# EAGLE schematic circuit (EAGLE 9.6.2)
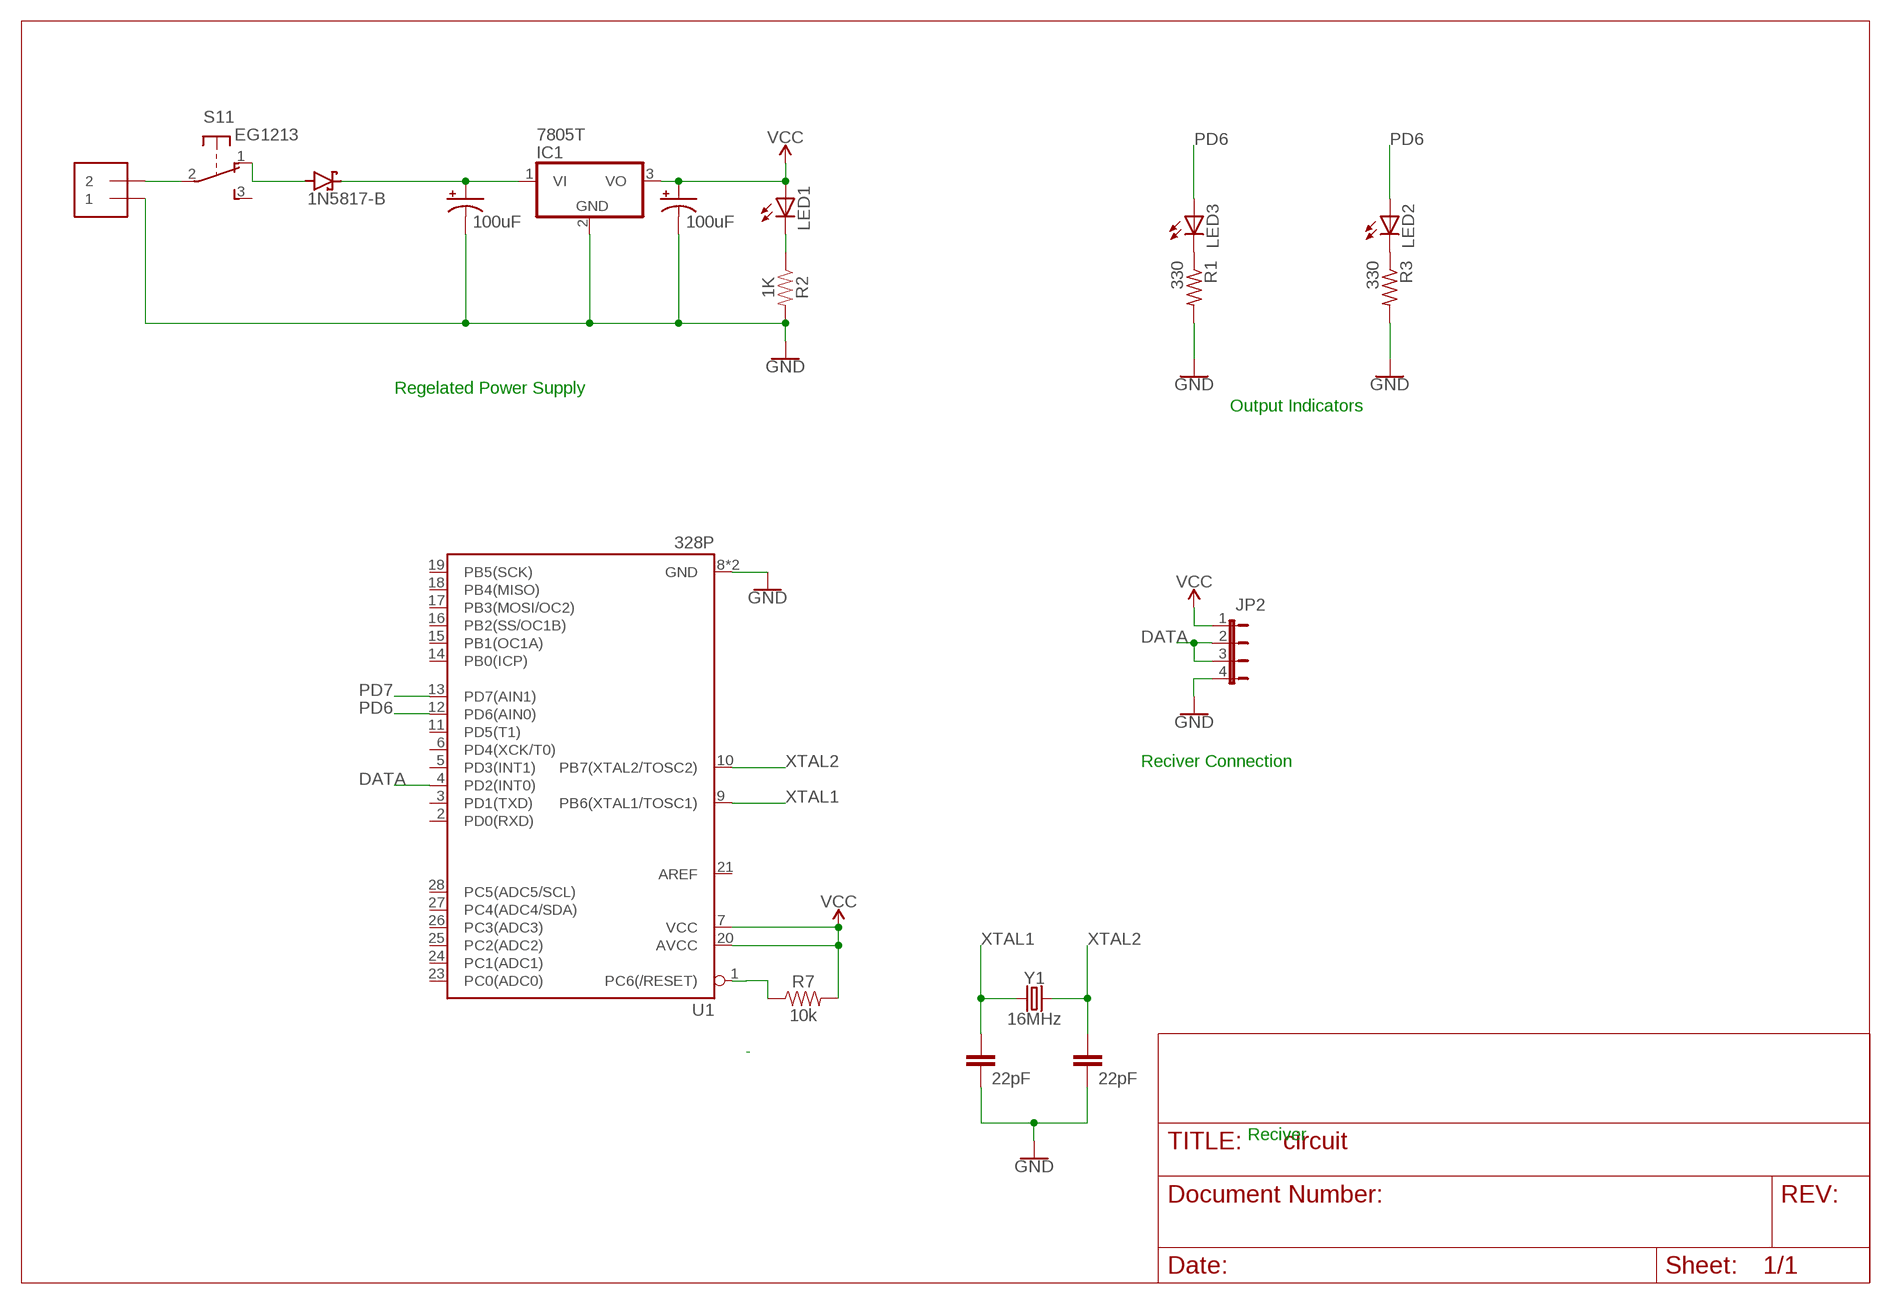
[diagram p0: schematic, sheet 1]

## Parts
$1_0_$_2023-02-20_05-34-40  100uF  100UF-POLAR-RADIAL-2.5MM-25V-20%  [CPOL-RADIAL-2.5MM-6.5MM]
$1_1_$_2023-02-20_05-34-40  100uF  100UF-POLAR-RADIAL-2.5MM-25V-20%  [CPOL-RADIAL-2.5MM-6.5MM]
$1_2_$_2023-02-20_05-34-40  22pF  22PF-PTH-2.54MM-200V-5%  [CAP-PTH-2.54]
$1_3_$_2023-02-20_05-34-40  22pF  22PF-PTH-2.54MM-200V-5%  [CAP-PTH-2.54]
$1_4_$_2023-02-20_05-34-40  1N5817-B  [DO41-7.6]
IC1  7805T  [TO220H]
J1  1X2-3.5MM  [1X2-3.5MM]
JP2  JP4E  [JP4]
LED1  LED3MM  [LED3MM]
LED2  LED3MM  [LED3MM]
LED3  LED3MM  [LED3MM]
R1  330  R-US_0207/5V  [0207/5V]
R2  1K  RESISTORAXIAL-0.3  [AXIAL-0.3]
R3  330  R-US_0207/5V  [0207/5V]
R7  10k  RESISTORAXIAL-0.3  [AXIAL-0.3]
S1  EG1213  [EG1213]
U1  328P  ATMEGA328P_PDIP  [DIP28]
Y1  16MHz  CRYSTAL-16MHZPTH-HC49US  [HC49US]

## Nets
DATA: JP2.2 JP2.3 U1.4(PD2(INT0))
GND: $1_0_$_2023-02-20_05-34-40.2(-) $1_1_$_2023-02-20_05-34-40.2(-) $1_2_$_2023-02-20_05-34-40.2 $1_3_$_2023-02-20_05-34-40.2 IC1.2(GND) J1.1 JP2.4 R1.2 R2.P$2 R3.2 U1.8(GND) U1.22(GND)
N$1: J1.2 S1.2(1:P)
N$2: $1_0_$_2023-02-20_05-34-40.1(+) $1_4_$_2023-02-20_05-34-40.C IC1.1(VI)
N$3: R7.P$1 U1.1(PC6(/RESET))
N$5: LED1.K(C) R2.P$1
N$6: $1_4_$_2023-02-20_05-34-40.A S1.1(1:O)
N$7: LED3.K(C) R1.1
N$8: LED2.K(C) R3.1
PD6: LED2.A LED3.A U1.12(PD6(AIN0))
PD7: U1.13(PD7(AIN1))
VCC: $1_1_$_2023-02-20_05-34-40.1(+) IC1.3(VO) JP2.1 LED1.A R7.P$2 U1.7(VCC) U1.20(AVCC)
XTAL1: $1_2_$_2023-02-20_05-34-40.1 U1.9(PB6(XTAL1/TOSC1)) Y1.1
XTAL2: $1_3_$_2023-02-20_05-34-40.1 U1.10(PB7(XTAL2/TOSC2)) Y1.2
Unconnected: S1.3(1:S) S1.MT1(MT) S1.MT2(MT) U1.2(PD0(RXD)) U1.3(PD1(TXD)) U1.5(PD3(INT1)) U1.6(PD4(XCK/T0)) U1.11(PD5(T1)) U1.14(PB0(ICP)) U1.15(PB1(OC1A)) U1.16(PB2(SS/OC1B)) U1.17(PB3(MOSI/OC2)) U1.18(PB4(MISO)) U1.19(PB5(SCK)) U1.21(AREF) U1.23(PC0(ADC0)) U1.24(PC1(ADC1)) U1.25(PC2(ADC2)) U1.26(PC3(ADC3)) U1.27(PC4(ADC4/SDA)) U1.28(PC5(ADC5/SCL))

## Notes on the sheet
- Regelated Power Supply
- Output Indicators
- Reciver Connection
- Reciver

## Library data of the parts
$1_0_$_2023-02-20_05-34-40 $1_1_$_2023-02-20_05-34-40 = SparkFun-Capacitors:100UF-POLAR: 100µF polarized capacitors A capacitor is a passive two-terminal electrical component used to store electrical energy temporarily in an electric field.; PROD_ID: CAP-08439
$1_2_$_2023-02-20_05-34-40 $1_3_$_2023-02-20_05-34-40 = SparkFun-Capacitors:22PF: 22pF ceramic capacitors A capacitor is a passive two-terminal electrical component used to store electrical energy temporarily in an electric field.; PROD_ID: CAP-09128
$1_4_$_2023-02-20_05-34-40 = diode:1N581*: 1.0A SCHOTTKY BARRIER RECTIFIER Source: http://www.diodes.com/datasheets/ds23001.pdf
IC1 = adafruit:78*: Positive VOLTAGE REGULATOR Added bigger pads to the TO-92 package
J1 = adafruit:1X2: 3.5mm Terminal block http://www.ladyada.net/library/pcb/eaglelibrary.html
JP2 = jumper:JP4E: JUMPER
LED1-LED3 = adafruit:LED: LED OSRAM: - CHIPLED LG R971, LG N971, LY N971, LG Q971, LY Q971, LO R971, LY R971 LH N974, LH R974 LS Q976, LO Q976, LY Q976 LO Q996 - Hyper CHIPLED LW Q18S LB Q993, LB Q99A, LB R99A - SideLED LS A670, LO A670, LY A670, LG A670, LP A670 LB A673, LV A673, LT A673, LW A673 LH A674 LY A675 LS A676, LA A676, LO A676, LY A676, LW A676 LS A679, LY A679, LG A679 - Hyper Micro SIDELED® LS Y876, LA Y876, LO Y876, LY Y876 LT Y87S - SmartLED LW L88C, LW L88S LB L89C, LB L89S, LG L890 LS L89K, LO L89K, LY L89K LS L896, LA L896, LO L896, LY L896 - TOPLED LS T670, LO T670, LY T670, LG T670, LP T670 LSG T670, LSP T670, LSY T670, LOP T670, LYG T670 LG T671, LOG T671, LSG T671 LB T673, LV T673, LT T673, LW T673 LH T674 LS T676, LA T676, LO T676, LY T676, LB T676, LH T676, LSB T676, LW T676 LB T67C, LV T67C, LT T67C, LS T67K, LO T67K, LY T67K, LW E67C LS E67B, LA E67B, LO E67B, LY E67B, LB E67C, LV E67C, LT E67C LW T67C LS T679, LY T679, LG T679 LS T770, LO T770, LY T770, LG T770, LP T770 LB T773, LV T773, LT T773, LW T773 LH T774 LS E675, LA E675, LY E675, LS T675 LS T776, LA T776, LO T776, LY T776, LB T776 LHGB T686 LT T68C, LB T68C - Hyper Mini TOPLED® LB M676 - Mini TOPLED Santana® LG M470 LS M47K, LO M47K, LY M47K Source: http://www.osram.convergy.de/
R1 R3 = adafruit:R-US_: RESISTOR, American symbol
R2 R7 = SparkFun-Resistors:RESISTOR: Generic Resistor Package
S1 = adafruit:EG1213: E-Switch right-angle slide SPDT Part #EG1213 http://www.ladyada.net/library/eagle
U1 = SparkFun-IC-Microcontroller:ATMEGA328P_PDIP: Atmel 328P Through hole ATMEGA328P uC used in the Arduino 32kb flash, 1k EEPROM, 2k SRAM Datasheet <http://www.sparkfun.com/datasheets/Components/SMD/ATMega328.pdf> SparkFun Products Storefront component: AVR 28 Pin 20MHz 32K 6A/D - ATMega328P <https://www.sparkfun.com/products/9061> (COM-09061) SparkFun Simon Says - Through-Hole Soldering Kit <https://www.sparkfun.com/products/10547> (KIT-10547) SparkFun Learn to Solder - Simon Says <https://www.sparkfun.com/products/13708> (KIT-13708) SparkFun BigTime Watch Kit <https://www.sparkfun.com/products/11734> (KIT-11734) SparkFun ClockIt <https://www.sparkfun.com/products/10930> (KIT-10930) SparkFun Serial Enabled LCD Kit <https://www.sparkfun.com/products/10097> (LCD-10097) SparkFun Simon Tilts - Through Hole Soldering Kit <https://www.sparkfun.com/products/12634> (KIT-12634) SparkFun Frequency Counter Kit <https://www.sparkfun.com/products/10140> (KIT-10140) FabFM Radio Kit <https://www.sparkfun.com/products/11043> (KIT-11043) SparkFun Binary Blaster Kit <https://www.sparkfun.com/products/12037> (KIT-12037) SparkFun Metro-Gnome <https://www.sparkfun.com/products/9236> (KIT-09236) ATmega328 with Arduino Optiboot (Uno) <https://www.sparkfun.com/products/10524> (DEV-10524); PROD_ID: IC-09136
Y1 = SparkFun-Clocks:CRYSTAL-16MHZ: 16MHz Crystal Digikey Example <http://www.digikey.com/product-search/en?keywords=535-9122-1-ND> Frequency: 16MHz Frequency Stability: ±50ppm Frequency Tolerance: ±20ppm Load Capacitance: 18pF SparkFun Products: Pro Micro -5V/16MHz <https://www.sparkfun.com/products/12640> SparkFun Serial Enabled LCD Kit <https://www.sparkfun.com/products/10097>; PROD_ID: XTAL-08181; SF_ID: COM-00536